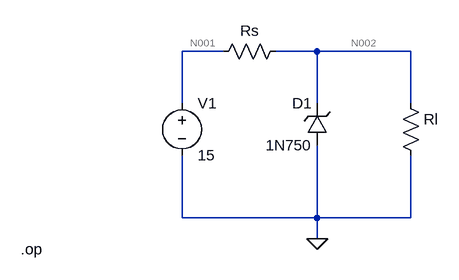
[diagram p0: schematic Zener Diode Reg.asc]
Zener Diode Reg.asc, the LTspice schematic file:
Version 4
SHEET 1 880 680
WIRE 160 48 96 48
WIRE 304 48 240 48
WIRE 448 48 304 48
WIRE 96 128 96 48
WIRE 304 128 304 48
WIRE 448 128 448 48
WIRE 96 304 96 208
WIRE 304 304 304 192
WIRE 304 304 96 304
WIRE 448 304 448 208
WIRE 448 304 304 304
WIRE 304 336 304 304
FLAG 304 336 0
SYMBOL voltage 96 112 R0
WINDOW 123 0 0 Left 0
WINDOW 39 0 0 Left 0
SYMATTR InstName V1
SYMATTR Value 15
SYMBOL res 256 32 R90
WINDOW 0 0 56 VBottom 2
WINDOW 3 32 56 VTop 2
SYMATTR InstName Rs
SYMATTR Value ""
SYMBOL res 432 112 R0
SYMATTR InstName Rl
SYMATTR Value ""
SYMBOL zener 320 192 R180
WINDOW 0 24 64 Left 2
WINDOW 3 24 0 Left 2
SYMATTR InstName D1
SYMATTR Value 1N750
TEXT -152 352 Left 2 !.op

The netlist it stands for:
* Zener Diode Reg.asc
V1 N001 0 15
Rs N002 N001
Rl N002 0
D1 0 N002 1N750
.model D D
.lib standard.dio
.op
.backanno
.end

* Results of the author's LTspice run, read from the files saved beside the schematic
* Operating Point:
*   V(n001) = 15 V
*   V(n002) = 4.656 V
*   I(D1) = -8.792 mA
*   I(Rs) = -10.34 mA
*   I(Rl) = 1.552 mA
*   I(V1) = -10.34 mA
* From the log:
*   Semiconductor Device Operating Points:
*                           --- Diodes ---
*   Name:      d1
*   Model:    1n750
*   Id:     -8.79e-03
*   Vd:     -4.66e+00
*   Req:     6.06e+00
*   CAP:     5.91e-11